# Altium project YarnControl_Mainboard_v1.5.PrjPCB
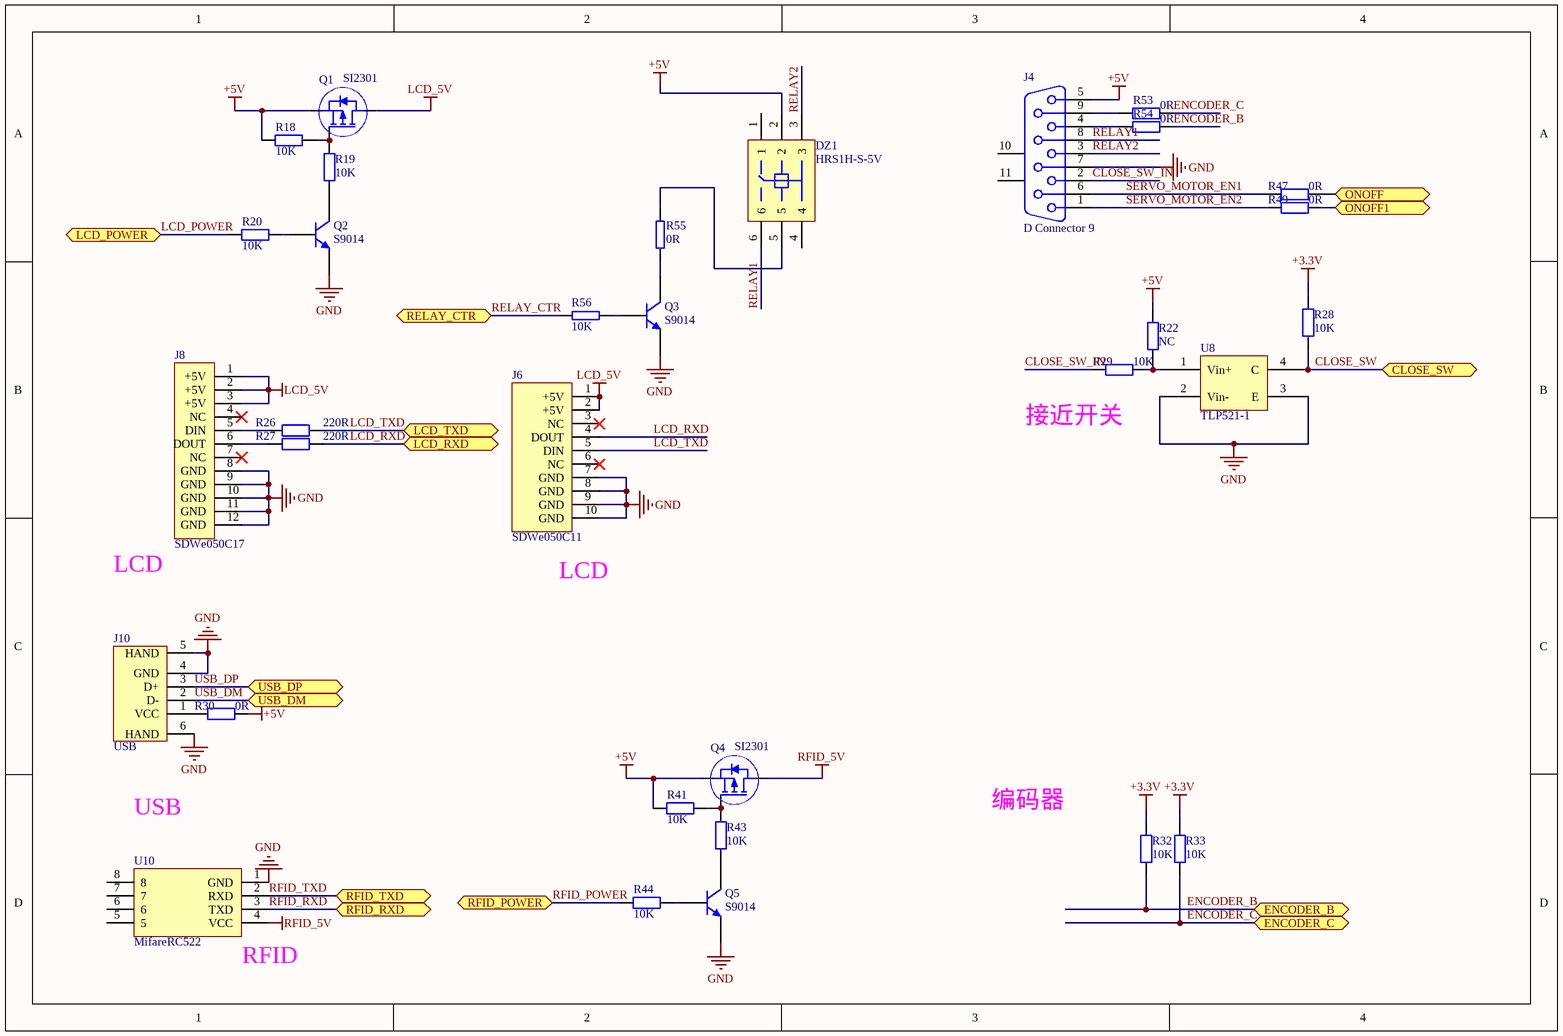
[diagram p0: mainboard_interface.v1.5.SchDoc]
4 sheets, 123 parts. Net scope: flat (ports and power ports of the same name join across sheets).
Board file: YarnControl_Mainboard_v1.5.PcbDoc
Sheets:
  mainboard_interface.v1.5.SchDoc
  mainboard_mcu.v1.5.SchDoc
  mainboard_motor.v1.5.SchDoc
  mainboard_rs485.v1.5.SchDoc

## Sheet mainboard_interface.v1.5.SchDoc
size A4

### Parts
DZ1  HRS1H-S-5V  [HRS1H-S-DC5]
J4  D Connector 9  [DSUB1.385-2H9]
J6  SDWe050C11  [8PIN_2.0SMD]
J8  SDWe050C17  [FCC1.0-10]
J10  USB  [USB_FEMALE_A]
Q1  SI2301  [MOS-N_SOT-23]
Q2  S9014  [901X_SOT-23]
Q3  S9014  [901X_SOT-23]
Q4  SI2301  [MOS-N_SOT-23]
Q5  S9014  [901X_SOT-23]
R18  10K  [0805]
R19  10K  [0805]
R20  10K  [0805]
R22  NC  [0805]
R26  220R  [0805]
R27  220R  [0805]
R28  10K  [0805]
R29  10K  [0805]
R30  0R  [0805]
R32  10K  [0805]
R33  10K  [0805]
R41  10K  [0805]
R43  10K  [0805]
R44  10K  [0805]
R47  0R  [0805]
R49  0R  [0805]
R53  0R  [0805]
R54  0R  [0805]
R55  0R  [0805]
R56  10K  [0805]
U8  TLP521-1  [TLP521-1]
U10  MifareRC522  [MifareRC522]

### Ports
CLOSE_SW, ENCODER_B, ENCODER_C, LCD_POWER, LCD_RXD, LCD_TXD, ONOFF, ONOFF1, RELAY_CTR, RFID_POWER, RFID_RXD, RFID_TXD, USB_DM, USB_DP

### Nets
+3.3V: R28.1 R32.1 R33.1
+5V: DZ1.2 J4.5 Q1.S Q4.S R18.1 R22.1 R30.1 R41.1
GND: J4.7 J6.7(GND) J6.8(GND) J6.9(GND) J6.10(GND) J8.8(GND) J8.9(GND) J8.10(GND) J8.11(GND) J8.12(GND) J10.4(GND) J10.5(HAND) J10.6(HAND) Q2.3(E) Q3.3(E) Q5.3(E) U8.2(Vin-) U8.3(E) U10.1(GND)
LCD_5V: J6.1(+5V) J6.2(+5V) J8.1(+5V) J8.2(+5V) J8.3(+5V) Q1.D
RFID_5V: Q4.D U10.4(VCC)
CLOSE_SW: R28.2 U8.4(C) ; port CLOSE_SW
CLOSE_SW_IN: J4.2 R29.2
ENCODER_B: R32.2 R54.2 ; port ENCODER_B
ENCODER_C: R33.2 R53.2 ; port ENCODER_C
LCD_POWER: R20.1 ; port LCD_POWER
LCD_RXD: J6.4(DOUT) R27.2 ; port LCD_RXD
LCD_TXD: J6.5(DIN) R26.2 ; port LCD_TXD
ONOFF: R47.1 ; port ONOFF
ONOFF1: R49.1 ; port ONOFF1
RELAY1: DZ1.6 J4.8
RELAY2: DZ1.3 J4.3
RELAY_CTR: R56.2 ; port RELAY_CTR
RFID_POWER: R44.1 ; port RFID_POWER
RFID_RXD: U10.3(TXD) ; port RFID_RXD
RFID_TXD: U10.2(RXD) ; port RFID_TXD
SERVO_MOTOR_EN1: J4.6 R47.2
SERVO_MOTOR_EN2: J4.1 R49.2
USB_DM: J10.2(D-) ; port USB_DM
USB_DP: J10.3(D+) ; port USB_DP
NetDZ1_5: DZ1.5 R55.2
NetJ4_4: J4.4 R54.1
NetJ4_9: J4.9 R53.1
NetJ8_5: J8.5(DIN) R26.1
NetJ8_6: J8.6(DOUT) R27.1
NetJ10_1: J10.1(VCC) R30.2
NetQ1_G: Q1.G R18.2 R19.2
NetQ2_1: Q2.1(C) R19.1
NetQ2_2: Q2.2(B) R20.2
NetQ3_1: Q3.1(C) R55.1
NetQ3_2: Q3.2(B) R56.1
NetQ4_G: Q4.G R41.2 R43.2
NetQ5_1: Q5.1(C) R43.1
NetQ5_2: Q5.2(B) R44.2
NetR22_2: R22.2 R29.1 U8.1(Vin+)

Not connected (* = marked no-connect by the designer): DZ1 1 4; J4 10(MH1) 11(MH2); J6 3(NC)* 6(NC)*; J8 4(NC)* 7(NC)*; U10 5 6 7 8

### Notes on the sheet
- (near R29) 接近开关
- LCD
- (near J6) LCD
- USB
- 编码器
- (near U10) RFID

### Library data of the parts
J4 = D Connector 9: Receptacle Assembly, 9 Position, Right Angle; PackageDocument: O; Positions: 9; Published: 15-Jun-2001; LatestRevisionDate: 17-Jul-2002; LatestRevisionNote: Re-released for DXP Platform.; DatasheetDocument: 1-Sep-1999; PackageReference: 788750; Publisher: Altium Limited; Orientation: Right Angle; Gender: Receptacle
J6 = SDWe043T04
J8 = SH-12
Q1 Q4 = MOS-P_SOT-23
Q2 Q3 Q5 = NPN
R18-R20 R22 R26-R30 R32 R33 R41 R43 R44 R47 R49 R53 R54 = Res2: Resistor; Value: 1K; Published: 8-Jun-2000; LatestRevisionDate: 17-Jul-2002; LatestRevisionNote: Re-released for DXP Platform.; PackageReference: AXIAL-0.4; Publisher: Altium Limited
R55 R56 = RES: 电阻

## Sheet mainboard_mcu.v1.5.SchDoc
size A3
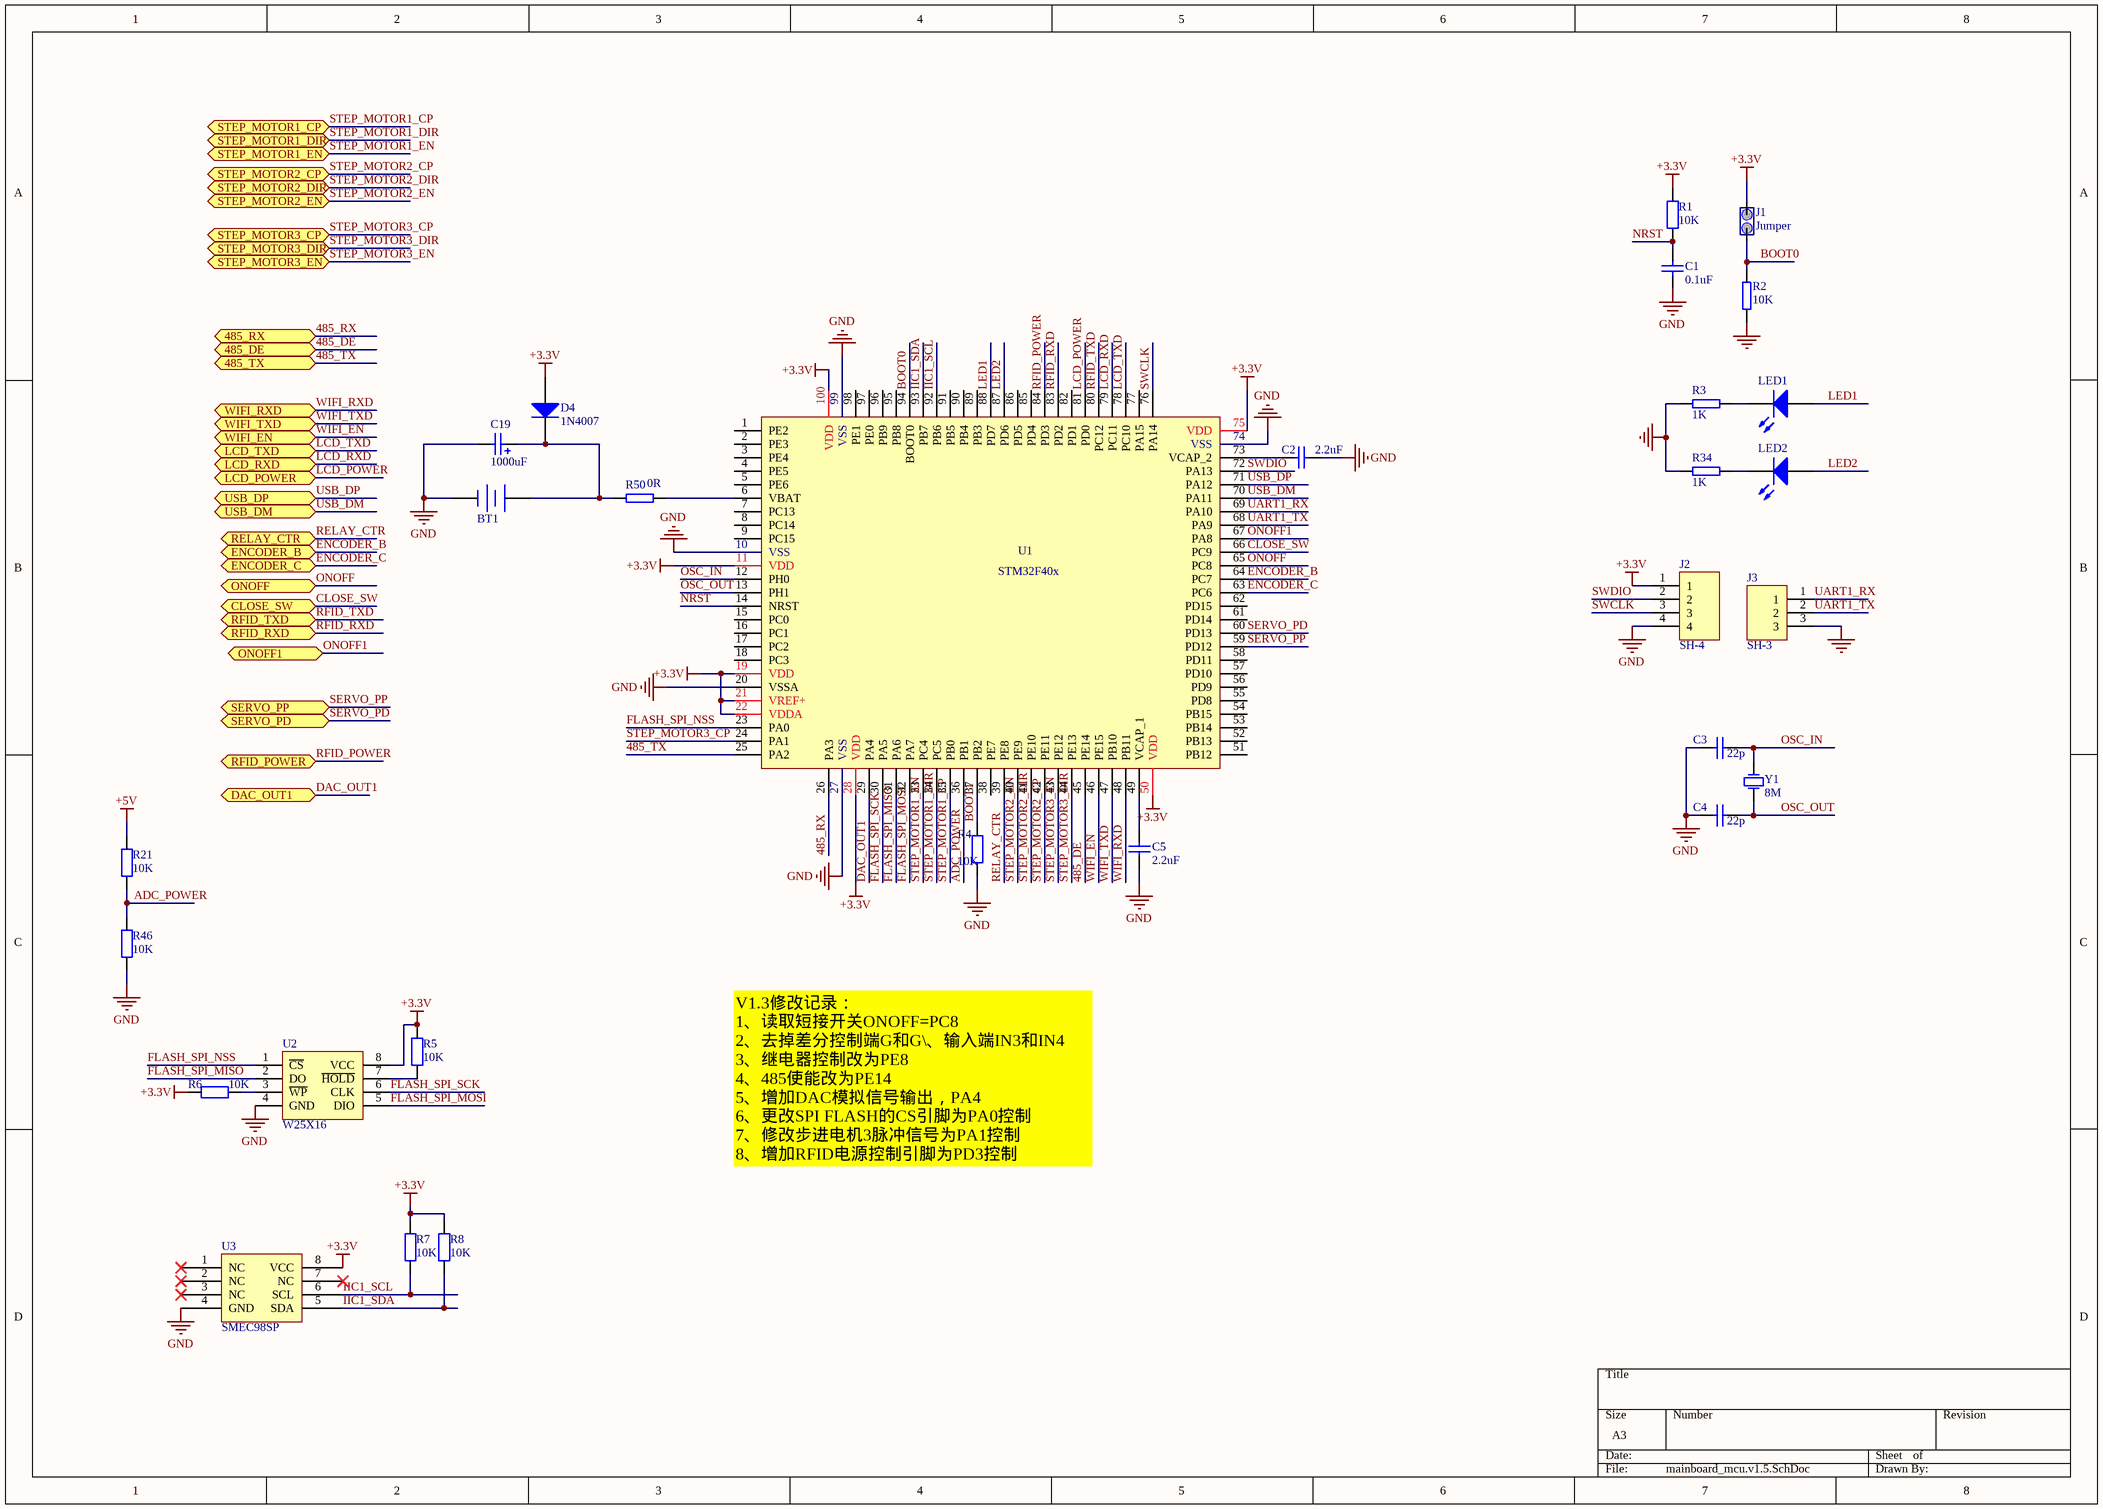
[diagram p1: mainboard_mcu.v1.5.SchDoc]

### Parts
BT1  CR1220  [CR1220]  (value not drawn)
C1  0.1uF  [0805]
C2  2.2uF  [0805]
C3  22p  [0805]
C4  22p  [0805]
C5  2.2uF  [0805]
C19  1000uF  [CAP_SMT_10X10]
D4  1N4007  [Diode_TP]
J1  Jumper  [J254-2]
J2  SH-4  [J254-4]
J3  SH-3  [J2.54-3]
LED1  GREEN  [LED]  (value not drawn)
LED2  GREEN  [LED]  (value not drawn)
R1  10K  [0805]
R2  10K  [0805]
R3  1K  [0805]
R4  10K  [0805]
R5  10K  [0805]
R6  10K  [0805]
R7  10K  [0805]
R8  10K  [0805]
R21  10K  [0805]
R34  1K  [0805]
R46  10K  [0805]
R50  0R  [0805]
U1  STM32F40x  [TQFP100]
U2  W25X16  [SOP8]
U3  SMEC98SP  [SO-8]
Y1  8M  [XTAL]

### Ports
485_DE, 485_RX, 485_TX, CLOSE_SW, DAC_OUT1, ENCODER_B, ENCODER_C, LCD_POWER, LCD_RXD, LCD_TXD, ONOFF, ONOFF1, RELAY_CTR, RFID_POWER, RFID_RXD, RFID_TXD, SERVO_PD, SERVO_PP, STEP_MOTOR1_CP, STEP_MOTOR1_DIR, STEP_MOTOR1_EN, STEP_MOTOR2_CP, STEP_MOTOR2_DIR, STEP_MOTOR2_EN, STEP_MOTOR3_CP, STEP_MOTOR3_DIR, STEP_MOTOR3_EN, USB_DM, USB_DP, WIFI_EN, WIFI_RXD, WIFI_TXD

### Nets
+3.3V: D4.1(A) J1.2 J2.1 R1.2 R5.1 R6.2 R7.2 R8.2 U1.11(VDD) U1.19(VDD) U1.21(VREF+) U1.22(VDDA) U1.28(VDD) U1.50(VDD) U1.75(VDD) U1.100(VDD) U2.8(VCC) U3.8(VCC)
+5V: R21.2
GND: BT1.2(-) C1.1 C2.1 C3.2 C4.2 C5.2 C19.2 J2.4 J3.3 R2.2 R3.2 R4.2 R34.2 R46.1 U1.10(VSS) U1.20(VSSA) U1.27(VSS) U1.74(VSS) U1.99(VSS) U2.4(GND) U3.4(GND)
485_DE: U1.45(PE14) ; port 485_DE
485_RX: U1.26(PA3) ; port 485_RX
485_TX: U1.25(PA2) ; port 485_TX
ADC_POWER: R21.1 R46.2 U1.36(PB1)
BOOT0: J1.1 R2.1 U1.94(BOOT0)
BOOT1: R4.1 U1.37(PB2)
CLOSE_SW: U1.66(PC9) ; port CLOSE_SW
DAC_OUT1: U1.29(PA4) ; port DAC_OUT1
ENCODER_B: U1.64(PC7) ; port ENCODER_B
ENCODER_C: U1.63(PC6) ; port ENCODER_C
FLASH_SPI_MISO: U1.31(PA6) U2.2(DO)
FLASH_SPI_MOSI: U1.32(PA7) U2.5(DIO)
FLASH_SPI_NSS: U1.23(PA0) U2.1(~{CS})
FLASH_SPI_SCK: U1.30(PA5) U2.6(CLK)
IIC1_SCL: R7.1 U1.92(PB6) U3.6(SCL)
IIC1_SDA: R8.1 U1.93(PB7) U3.5(SDA)
LCD_POWER: U1.81(PD0) ; port LCD_POWER
LCD_RXD: U1.79(PC11) ; port LCD_RXD
LCD_TXD: U1.78(PC10) ; port LCD_TXD
LED1: LED1.1(A) U1.88(PD7)
LED2: LED2.1(A) U1.87(PD6)
NRST: C1.2 R1.1 U1.14(NRST)
ONOFF: U1.65(PC8) ; port ONOFF
ONOFF1: U1.67(PA8) ; port ONOFF1
OSC_IN: C3.1 U1.12(PH0) Y1.2(OSC2)
OSC_OUT: C4.1 U1.13(PH1) Y1.1(OSC1)
RELAY_CTR: U1.39(PE8) ; port RELAY_CTR
RFID_POWER: U1.84(PD3) ; port RFID_POWER
RFID_RXD: U1.83(PD2) ; port RFID_RXD
RFID_TXD: U1.80(PC12) ; port RFID_TXD
SERVO_PD: U1.60(PD13) ; port SERVO_PD
SERVO_PP: U1.59(PD12) ; port SERVO_PP
STEP_MOTOR1_CP: U1.35(PB0) ; port STEP_MOTOR1_CP
STEP_MOTOR1_DIR: U1.34(PC5) ; port STEP_MOTOR1_DIR
STEP_MOTOR1_EN: U1.33(PC4) ; port STEP_MOTOR1_EN
STEP_MOTOR2_CP: U1.42(PE11) ; port STEP_MOTOR2_CP
STEP_MOTOR2_DIR: U1.41(PE10) ; port STEP_MOTOR2_DIR
STEP_MOTOR2_EN: U1.40(PE9) ; port STEP_MOTOR2_EN
STEP_MOTOR3_CP: U1.24(PA1) ; port STEP_MOTOR3_CP
STEP_MOTOR3_DIR: U1.44(PE13) ; port STEP_MOTOR3_DIR
STEP_MOTOR3_EN: U1.43(PE12) ; port STEP_MOTOR3_EN
SWCLK: J2.3 U1.76(PA14)
SWDIO: J2.2 U1.72(PA13)
UART1_RX: J3.1 U1.69(PA10)
UART1_TX: J3.2 U1.68(PA9)
USB_DM: U1.70(PA11) ; port USB_DM
USB_DP: U1.71(PA12) ; port USB_DP
WIFI_EN: U1.46(PE15) ; port WIFI_EN
WIFI_RXD: U1.48(PB11) ; port WIFI_RXD
WIFI_TXD: U1.47(PB10) ; port WIFI_TXD
NetBT1_1: BT1.1(+) C19.1 D4.2(K) R50.1
NetC2_2: C2.2 U1.73(VCAP_2)
NetC5_1: C5.1 U1.49(VCAP_1)
NetLED1_2: LED1.2(K) R3.1
NetLED2_2: LED2.2(K) R34.1
NetR5_2: R5.2 U2.7(~{HOLD})
NetR6_1: R6.1 U2.3(~{WP})
NetR50_2: R50.2 U1.6(VBAT)

Not connected (* = marked no-connect by the designer): U1 1(PE2) 2(PE3) 3(PE4) 4(PE5) 5(PE6) 7(PC13) 8(PC14) 9(PC15) 15(PC0) 16(PC1) 17(PC2) 18(PC3) 38(PE7) 51(PB12) 52(PB13) 53(PB14) 54(PB15) 55(PD8) 56(PD9) 57(PD10) 58(PD11) 61(PD14) 62(PD15) 77(PA15) 82(PD1) 85(PD4) 86(PD5) 89(PB3) 90(PB4) 91(PB5) 95(PB8) 96(PB9) 97(PE0) 98(PE1); U3 1(NC)* 2(NC)* 3(NC)* 7(NC)*

### Notes on the sheet
- V1.3修改记录：
  1、读取短接开关ONOFF=PC8
  2、去掉差分控制端G和G\、输入端IN3和IN4
  3、继电器控制改为PE8
  4、485使能改为PE14
  5、增加DAC模拟信号输出，PA4
  6、更改SPI FLASH的CS引脚为PA0控制
  7、修改步进电机3脉冲信号为PA1控制
  8、增加RFID电源控制引脚为PD3控制

### Library data of the parts
BT1 = Battery: Multicell Battery; Published: 24-Mar-1999; Revision: July-2002: Re-released for DXP Platform.; Publisher: Altium Limited
C1-C5 = Cap: Capacitor; Value: 100pF; Published: 8-Jun-2000; LatestRevisionDate: 17-Jul-2002; LatestRevisionNote: Re-released for DXP Platform.; PackageReference: RAD-0.3; Publisher: Altium Limited
C19 = Cap Pol1: Polarized Capacitor (Radial); Value: 220uf; Published: 8-Jun-2000; Revision: July-2002: Re-released for DXP Platform.; Publisher: Altium Limited
D4 = Diode: Default Diode; Published: 8-Jun-2000; LatestRevisionDate: 17-Jul-2002; LatestRevisionNote: Re-released for DXP Platform.; PackageVersion: Sep-1996; PackageReference: SMC; Publisher: Altium Limited; Code_JEDEC: DO-214-AB
LED1 LED2 = LED2: Typical RED, GREEN, YELLOW, AMBER GaAs LED; Published: 8-Jun-2000; Revision: July-2002: Re-released for DXP Platform.; Publisher: Altium Limited
R1 R4-R8 R21 R46 = Res2: Resistor; Value: 1K; Published: 8-Jun-2000; LatestRevisionDate: 17-Jul-2002; LatestRevisionNote: Re-released for DXP Platform.; PackageReference: AXIAL-0.4; Publisher: Altium Limited
R2 R3 R34 R50 = RES: 电阻
Y1 = X-32.768: Crystal Oscillator; Published: 8-Jun-2000; LatestRevisionDate: 17-Jul-2002; LatestRevisionNote: Re-released for DXP Platform.; PackageReference: R38; Publisher: Altium Limited

## Sheet mainboard_motor.v1.5.SchDoc
size A4
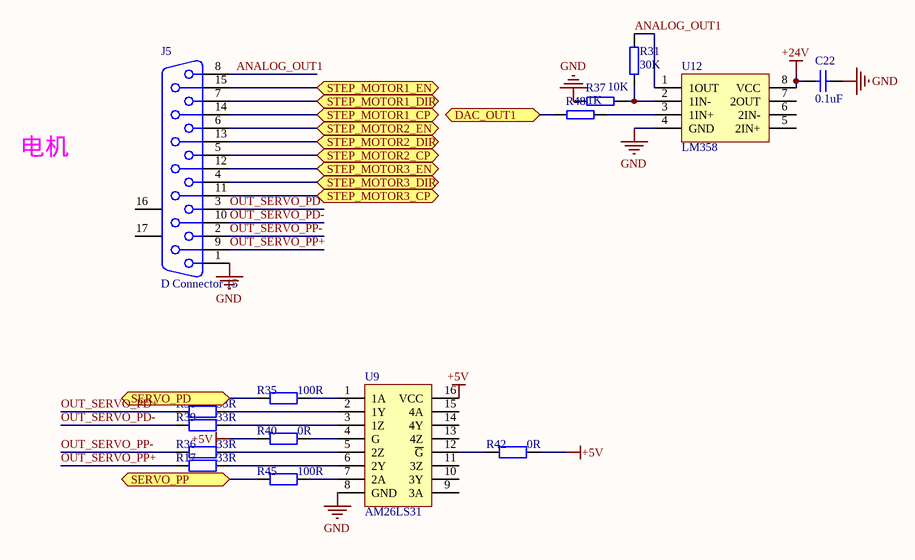
[diagram p2: mainboard_motor.v1.5.SchDoc]

### Parts
C22  0.1uF  [0805]
J5  D Connector 15  [DSUB1.385-2H15]
R17  33R  [0805]
R31  30K  [0805]
R35  100R  [0805]
R36  33R  [0805]
R37  10K  [0805]
R38  33R  [0805]
R39  33R  [0805]
R40  0R  [0805]
R42  0R  [0805]
R45  100R  [0805]
R48  1K  [0805]
U9  AM26LS31  [SO-16]
U12  LM358  [SO-8]

### Ports
DAC_OUT1, SERVO_PD, SERVO_PP, STEP_MOTOR1_CP, STEP_MOTOR1_DIR, STEP_MOTOR1_EN, STEP_MOTOR2_CP, STEP_MOTOR2_DIR, STEP_MOTOR2_EN, STEP_MOTOR3_CP, STEP_MOTOR3_DIR, STEP_MOTOR3_EN

### Nets
+5V: R40.2 R42.1 U9.16(VCC)
+24V: C22.2 U12.8(VCC)
GND: C22.1 J5.1 R37.2 U9.8(GND) U12.4(GND)
ANALOG_OUT1: J5.8 R31.1 U12.1(1OUT)
DAC_OUT1: R48.2 ; port DAC_OUT1
OUT_SERVO_PD+: J5.3 R38.2
OUT_SERVO_PD-: J5.10 R39.2
OUT_SERVO_PP+: J5.9 R17.2
OUT_SERVO_PP-: J5.2 R36.2
SERVO_PD: R35.2 ; port SERVO_PD
SERVO_PP: R45.2 ; port SERVO_PP
STEP_MOTOR1_CP: J5.14 ; port STEP_MOTOR1_CP
STEP_MOTOR1_DIR: J5.7 ; port STEP_MOTOR1_DIR
STEP_MOTOR1_EN: J5.15 ; port STEP_MOTOR1_EN
STEP_MOTOR2_CP: J5.5 ; port STEP_MOTOR2_CP
STEP_MOTOR2_DIR: J5.13 ; port STEP_MOTOR2_DIR
STEP_MOTOR2_EN: J5.6 ; port STEP_MOTOR2_EN
STEP_MOTOR3_CP: J5.11 ; port STEP_MOTOR3_CP
STEP_MOTOR3_DIR: J5.4 ; port STEP_MOTOR3_DIR
STEP_MOTOR3_EN: J5.12 ; port STEP_MOTOR3_EN
NetR17_1: R17.1 U9.6(2Y)
NetR31_2: R31.2 R37.1 U12.2(1IN-)
NetR35_1: R35.1 U9.1(1A)
NetR36_1: R36.1 U9.5(2Z)
NetR38_1: R38.1 U9.2(1Y)
NetR39_1: R39.1 U9.3(1Z)
NetR40_1: R40.1 U9.4(G)
NetR42_2: R42.2 U9.12(~{G})
NetR45_1: R45.1 U9.7(2A)
NetR48_1: R48.1 U12.3(1IN+)

Not connected (* = marked no-connect by the designer): J5 16(MH1) 17(MH2); U9 9(3A) 10(3Y) 11(3Z) 13(4Z) 14(4Y) 15(4A); U12 5(2IN+) 6(2IN-) 7(2OUT)

### Notes on the sheet
- 电机

### Library data of the parts
C22 = Cap: Capacitor; Value: 100pF; Published: 8-Jun-2000; LatestRevisionDate: 17-Jul-2002; LatestRevisionNote: Re-released for DXP Platform.; PackageReference: RAD-0.3; Publisher: Altium Limited
J5 = D Connector 15: Receptacle Assembly, 15 Position, Right Angle; PackageDocument: O; Positions: 15; Published: 15-Jun-2001; LatestRevisionDate: 17-Jul-2002; LatestRevisionNote: Re-released for DXP Platform.; DatasheetDocument: 1-Sep-99; PackageReference: 788757; Publisher: Altium Limited; Orientation: Right Angle; Gender: Receptacle
R17 R35 R36 R38-R40 R42 R45 = Res2: Resistor; Value: 1K; Published: 8-Jun-2000; LatestRevisionDate: 17-Jul-2002; LatestRevisionNote: Re-released for DXP Platform.; PackageReference: AXIAL-0.4; Publisher: Altium Limited
R31 R37 R48 = RES: 电阻

## Sheet mainboard_rs485.v1.5.SchDoc
size A4
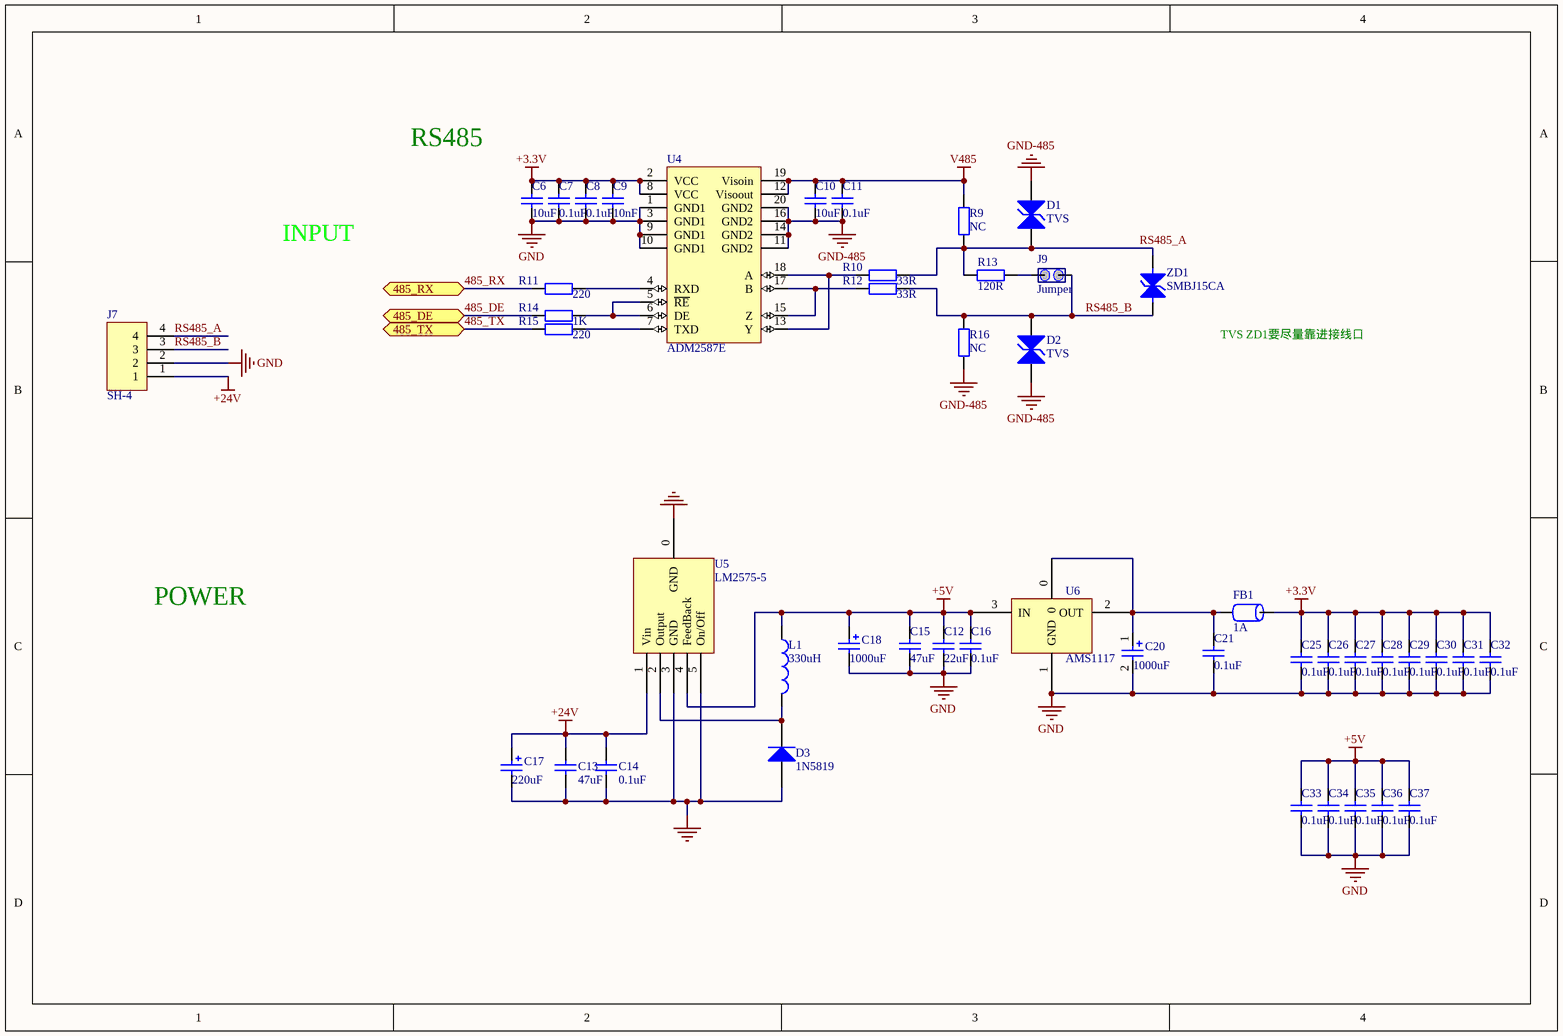
[diagram p3: mainboard_rs485.v1.5.SchDoc]

### Parts
C6  10uF  [0805]
C7  0.1uF  [0805]
C8  0.1uF  [0805]
C9  10nF  [0805]
C10  10uF  [0805]
C11  0.1uF  [0805]
C12  22uF  [1206]
C13  47uF  [1812]
C14  0.1uF  [0805]
C15  47uF  [1812]
C16  0.1uF  [0805]
C17  220uF  [CAP-5mm]
C18  1000uF  [CAP_SMT_10X10]
C20  1000uF  [CAP_SMT_10X10]
C21  0.1uF  [0805]
C25  0.1uF  [0805]
C26  0.1uF  [0805]
C27  0.1uF  [0805]
C28  0.1uF  [0805]
C29  0.1uF  [0805]
C30  0.1uF  [0805]
C31  0.1uF  [0805]
C32  0.1uF  [0805]
C33  0.1uF  [0805]
C34  0.1uF  [0805]
C35  0.1uF  [0805]
C36  0.1uF  [0805]
C37  0.1uF  [0805]
D1  TVS  [SMBJ_DO-214]
D2  TVS  [SMBJ_DO-214]
D3  1N5819  [Diode_TP2]
FB1  1A  [0805]
J7  SH-4  [PWR]
J9  Jumper  [J254-2]
L1  value 330uH  [Inductance]  (hidden comment: Inductor)
R9  NC  [0805]
R10  33R  [0805]
R11  220  [0805]
R12  33R  [0805]
R13  120R  [0805]
R14  1K  [0805]
R15  220  [0805]
R16  NC  [0805]
U4  ADM2587E  [SOIC_W_20]
U5  LM2575-5  [TO-263]
U6  AMS1117  [TO-223]
ZD1  SMBJ15CA  [DO-214AA/SMB]

### Ports
485_DE, 485_RX, 485_TX

### Nets
+3.3V: C6.2 C7.2 C8.2 C9.2 C25.2 C26.2 C27.2 C28.2 C29.2 C30.2 C31.2 C32.2 FB1.2 U4.2(VCC) U4.8(VCC)
+5V: C12.2 C15.2 C16.2 C18.1 C33.2 C34.2 C35.2 C36.2 C37.2 L1.1 U5.4(FeedBack) U6.3(IN)
+24V: C13.2 C14.2 C17.1 J7.1 U5.1(Vin)
GND: C6.1 C7.1 C8.1 C9.1 C12.1 C13.1 C14.1 C15.1 C16.1 C17.2 C18.2 C20.2 C21.1 C25.1 C26.1 C27.1 C28.1 C29.1 C30.1 C31.1 C32.1 C33.1 C34.1 C35.1 C36.1 C37.1 D3.1(A) J7.2 U4.1(GND1) U4.3(GND1) U4.9(GND1) U4.10(GND1) U5.0(GND) U5.3(GND) U5.5(On/Off) U6.1(GND)
GND-485: C10.1 C11.1 D1.1(A) D2.1(A) R16.1 U4.11(GND2) U4.14(GND2) U4.16(GND2) U4.20(GND2)
V485: C10.2 C11.2 R9.2 U4.12(Visoout) U4.19(Visoin)
485_DE: R14.1 ; port 485_DE
485_RX: R11.1 ; port 485_RX
485_TX: R15.1 ; port 485_TX
RS485_A: D1.2(K) J7.4 R9.1 R10.2 R13.2 ZD1.1
RS485_B: D2.2(K) J7.3 J9.1 R12.2 R16.2 ZD1.2
NetC20_1: C20.1 C21.2 FB1.1 U6.0 U6.2(OUT)
NetD3_2: D3.2(K) L1.2 U5.2(Output)
NetJ9_2: J9.2 R13.1
NetR10_1: R10.1 U4.13(Y) U4.18(A)
NetR11_2: R11.2 U4.4(RXD)
NetR12_1: R12.1 U4.15(Z) U4.17(B)
NetR14_2: R14.2 U4.5(~{RE}) U4.6(DE)
NetR15_2: R15.2 U4.7(TXD)

### Notes on the sheet
- RS485
- INPUT
- (near ZD1) TVS ZD1要尽量靠进接线口
- POWER

### Library data of the parts
C6-C11 = Cap: Capacitor; Value: 100pF; Published: 8-Jun-2000; LatestRevisionDate: 17-Jul-2002; LatestRevisionNote: Re-released for DXP Platform.; PackageReference: RAD-0.3; Publisher: Altium Limited
C12 C15 C16 C21 C25-C37 = Cap0805
C13 C14 = Cap: Capacitor; Published: 8-Jun-2000; Revision: July-2002: Re-released for DXP Platform.; Publisher: Altium Limited
C17 = Cap Pol1: Polarized Capacitor (Radial); Published: 8-Jun-2000; Revision: July-2002: Re-released for DXP Platform.; Publisher: Altium Limited; Value: 220uf
C18 C20 = Cap Pol1: as C19 on sheet mainboard_mcu.v1.5; Published: 8-Jun-2000; Revision: July-2002: Re-released for DXP Platform.; Publisher: Altium Limited
D3 = Diode 1N4148: High Conductance Fast Diode; Revision 1: 11-Jul-2000: SIM Model Added.; Revision 2: 17-Jul-2002: Re-released for DXP Platform.; Code - JEDEC: DO-204-AH; Published: 8-Jun-2000; Datasheet: Latest Revision: 1997; Package Reference: DO-35; Publisher: Altium Limited
FB1 = FERRITE
R9-R13 R15 R16 = Res2: Resistor; Value: 1K; Published: 8-Jun-2000; LatestRevisionDate: 17-Jul-2002; LatestRevisionNote: Re-released for DXP Platform.; PackageReference: AXIAL-0.4; Publisher: Altium Limited
R14 = Res2: Resistor; Published: 8-Jun-2000; LatestRevisionDate: 17-Jul-2002; LatestRevisionNote: Re-released for DXP Platform.; PackageReference: AXIAL-0.4; Publisher: Altium Limited; Value: 1K
U4 = ADM2587E: isolated DC-DC RS485
U5 = LM25XX
ZD1 = TVS: 瞬态抑制二极管
D1 D2 = TVS: Published: 8-Jun-2000; LatestRevisionDate: 17-Jul-2002; LatestRevisionNote: Re-released for DXP Platform.; PackageReference: DIODE-0.7; Publisher: Altium Limited
L1 = Inductor: Published: 8-Jun-2000; Revision: July-2002: Re-released for DXP Platform.; Publisher: Altium Limited

## Nets that join several sheets
+3.3V: mainboard_interface.v1.5 (R28.1 R32.1 R33.1), mainboard_mcu.v1.5 (18 pins), mainboard_rs485.v1.5 (15 pins)
+5V: mainboard_interface.v1.5 (8 pins), mainboard_mcu.v1.5 (R21.2), mainboard_motor.v1.5 (R40.2 R42.1 U9.16), mainboard_rs485.v1.5 (12 pins)
+24V: mainboard_motor.v1.5 (C22.2 U12.8), mainboard_rs485.v1.5 (5 pins)
GND: mainboard_interface.v1.5 (19 pins), mainboard_mcu.v1.5 (21 pins), mainboard_motor.v1.5 (5 pins), mainboard_rs485.v1.5 (36 pins)
485_DE: mainboard_mcu.v1.5 (U1.45), mainboard_rs485.v1.5 (R14.1)
485_RX: mainboard_mcu.v1.5 (U1.26), mainboard_rs485.v1.5 (R11.1)
485_TX: mainboard_mcu.v1.5 (U1.25), mainboard_rs485.v1.5 (R15.1)
CLOSE_SW: mainboard_interface.v1.5 (R28.2 U8.4), mainboard_mcu.v1.5 (U1.66)
DAC_OUT1: mainboard_mcu.v1.5 (U1.29), mainboard_motor.v1.5 (R48.2)
ENCODER_B: mainboard_interface.v1.5 (R32.2 R54.2), mainboard_mcu.v1.5 (U1.64)
ENCODER_C: mainboard_interface.v1.5 (R33.2 R53.2), mainboard_mcu.v1.5 (U1.63)
LCD_POWER: mainboard_interface.v1.5 (R20.1), mainboard_mcu.v1.5 (U1.81)
LCD_RXD: mainboard_interface.v1.5 (J6.4 R27.2), mainboard_mcu.v1.5 (U1.79)
LCD_TXD: mainboard_interface.v1.5 (J6.5 R26.2), mainboard_mcu.v1.5 (U1.78)
ONOFF: mainboard_interface.v1.5 (R47.1), mainboard_mcu.v1.5 (U1.65)
ONOFF1: mainboard_interface.v1.5 (R49.1), mainboard_mcu.v1.5 (U1.67)
RELAY_CTR: mainboard_interface.v1.5 (R56.2), mainboard_mcu.v1.5 (U1.39)
RFID_POWER: mainboard_interface.v1.5 (R44.1), mainboard_mcu.v1.5 (U1.84)
RFID_RXD: mainboard_interface.v1.5 (U10.3), mainboard_mcu.v1.5 (U1.83)
RFID_TXD: mainboard_interface.v1.5 (U10.2), mainboard_mcu.v1.5 (U1.80)
SERVO_PD: mainboard_mcu.v1.5 (U1.60), mainboard_motor.v1.5 (R35.2)
SERVO_PP: mainboard_mcu.v1.5 (U1.59), mainboard_motor.v1.5 (R45.2)
STEP_MOTOR1_CP: mainboard_mcu.v1.5 (U1.35), mainboard_motor.v1.5 (J5.14)
STEP_MOTOR1_DIR: mainboard_mcu.v1.5 (U1.34), mainboard_motor.v1.5 (J5.7)
STEP_MOTOR1_EN: mainboard_mcu.v1.5 (U1.33), mainboard_motor.v1.5 (J5.15)
STEP_MOTOR2_CP: mainboard_mcu.v1.5 (U1.42), mainboard_motor.v1.5 (J5.5)
STEP_MOTOR2_DIR: mainboard_mcu.v1.5 (U1.41), mainboard_motor.v1.5 (J5.13)
STEP_MOTOR2_EN: mainboard_mcu.v1.5 (U1.40), mainboard_motor.v1.5 (J5.6)
STEP_MOTOR3_CP: mainboard_mcu.v1.5 (U1.24), mainboard_motor.v1.5 (J5.11)
STEP_MOTOR3_DIR: mainboard_mcu.v1.5 (U1.44), mainboard_motor.v1.5 (J5.4)
STEP_MOTOR3_EN: mainboard_mcu.v1.5 (U1.43), mainboard_motor.v1.5 (J5.12)
USB_DM: mainboard_interface.v1.5 (J10.2), mainboard_mcu.v1.5 (U1.70)
USB_DP: mainboard_interface.v1.5 (J10.3), mainboard_mcu.v1.5 (U1.71)